# EAGLE design RF Glow Stick (EAGLE 6.5.0)
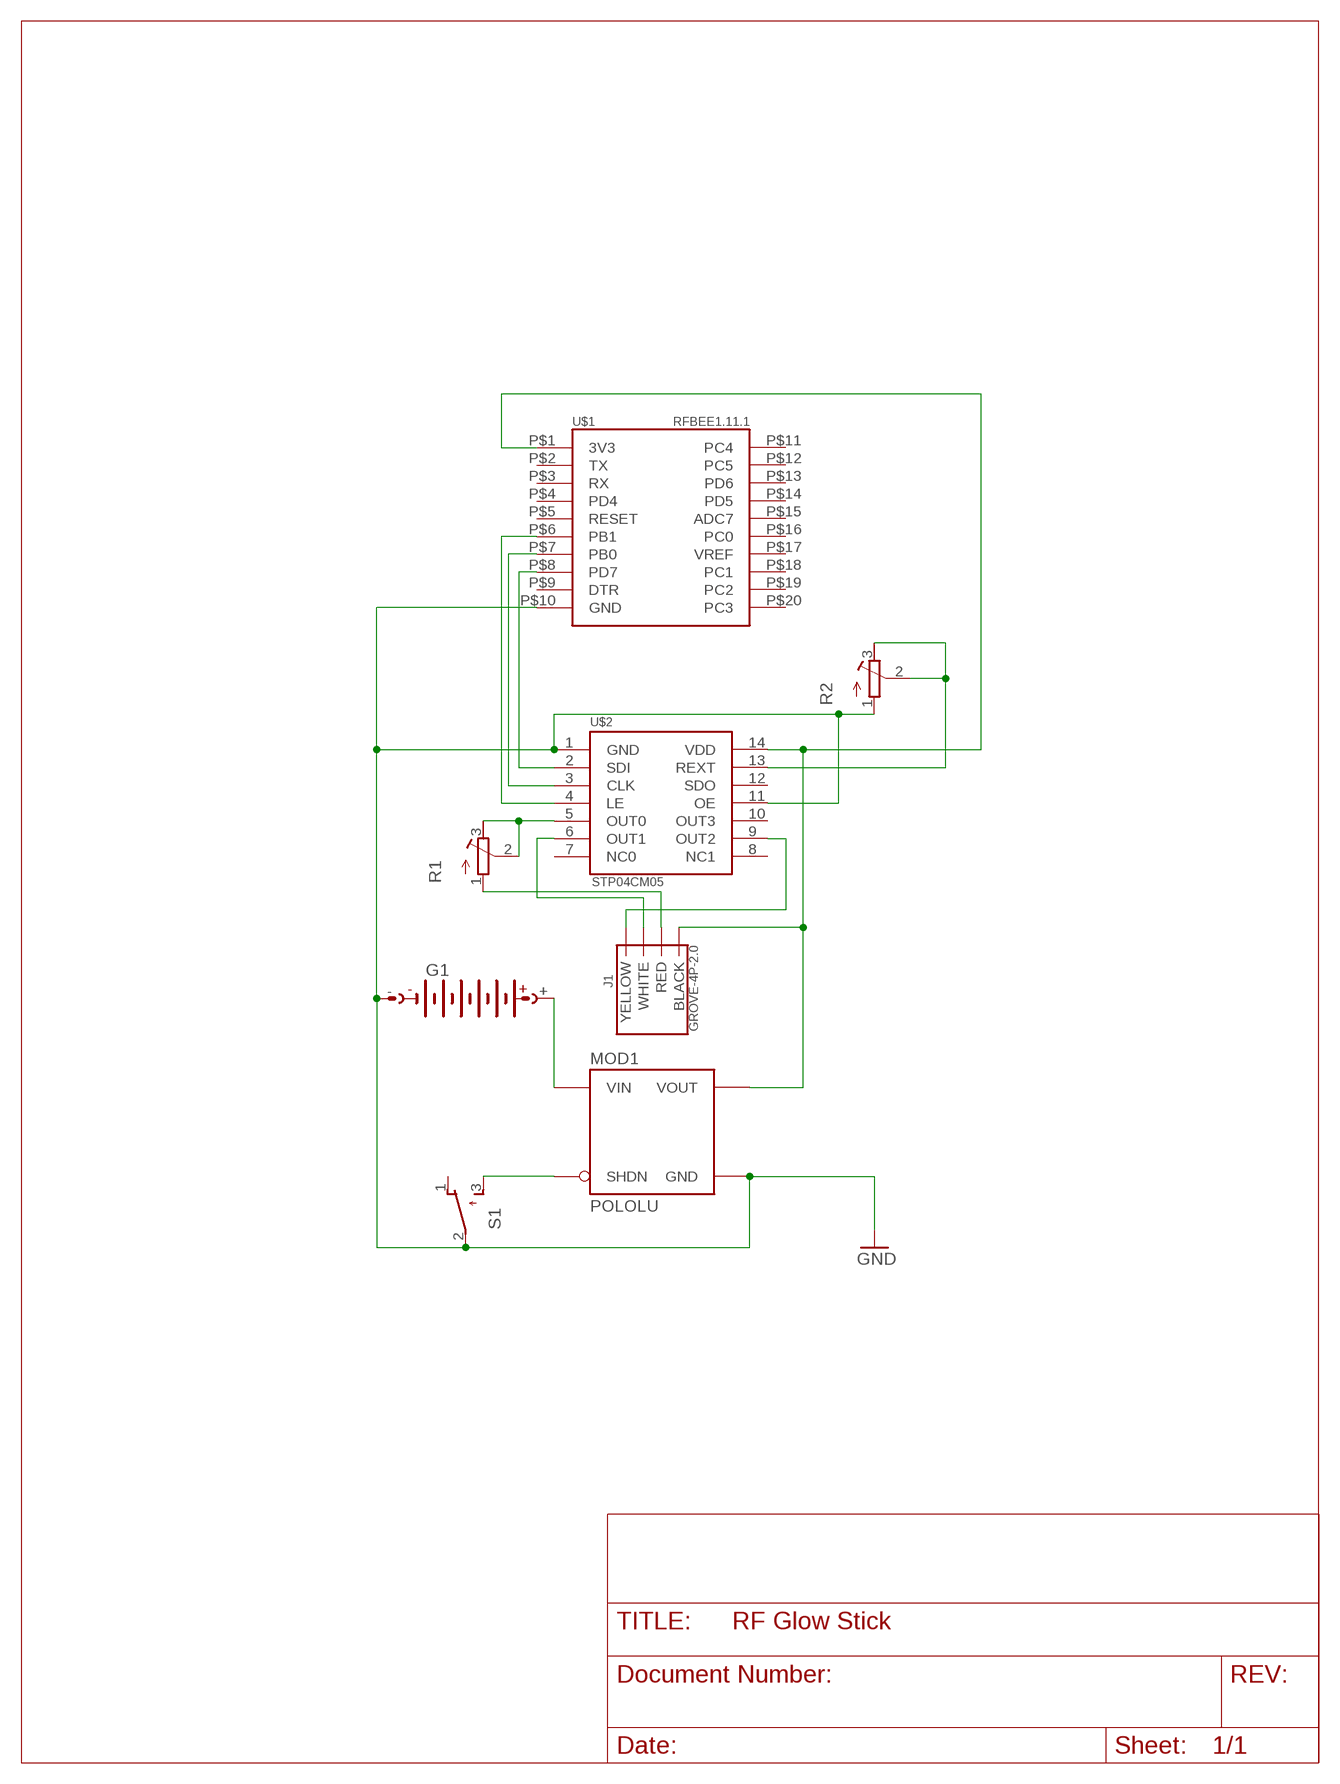
[diagram p0: schematic, sheet 1]

## Parts
G1  AB9V  [AB9V]
J1  GROVE-4P-2.0  [4P-2.0-90D]
MOD1  POLOLU  POLOLU_REG09BV  [POLOLU_REG09B]
R1  R-TRIMM3299W  [RTRIM3299W]
R2  R-TRIMM3299W  [RTRIM3299W]
S1  TL32PO  [TL3XPO]
U$1  RFBEE1.11.1  [RFBEE]
U$2  STP04CM05  STP04CM05STP04CM05  [DIL14]

## Nets
BATT: G1.+ MOD1.I(VIN)
GND: G1.- MOD1.G(GND) R2.1(A) S1.2(P) U$1.P$10(GND) U$2.1(GND) U$2.11(OE)
N$1: R1.2(S) R1.3(E) U$2.5(OUT0)
N$2: MOD1.S(SHDN) S1.3(S)
N$5: U$1.P$6(PB1) U$2.4(LE)
N$6: U$1.P$7(PB0) U$2.3(CLK)
N$7: U$1.P$8(PD7) U$2.2(SDI)
N$8: J1.RED R1.1(A)
N$9: J1.WHITE U$2.6(OUT1)
N$10: J1.YELLOW U$2.9(OUT2)
N$11: R2.2(S) R2.3(E) U$2.13(REXT)
VOUT: J1.BLACK MOD1.O(VOUT) U$1.P$1(3V3) U$2.14(VDD)
Unconnected: S1.1(O) U$1.P$2(TX) U$1.P$3(RX) U$1.P$4(PD4) U$1.P$5(RESET) U$1.P$9(DTR) U$1.P$11(PC4) U$1.P$12(PC5) U$1.P$13(PD6) U$1.P$14(PD5) U$1.P$15(ADC7) U$1.P$16(PC0) U$1.P$17(VREF) U$1.P$18(PC1) U$1.P$19(PC2) U$1.P$20(PC3) U$2.7(NC0) U$2.8(NC1) U$2.10(OUT3) U$2.12(SDO)

## Library data of the parts
G1 = battery:AB9V: 9-V BATTERY CLIP
J1 = My Library:GROVE-4P-2.0
MOD1 = My Library:POLOLU_REG09B*V: Pololu Adjustable Step Up/Down Voltage Regulators REG09B 0.4"x0.6" SOURCE www.pololu.com/ PACKAGE THT; 4-pin (0.1"); 0.4"x0.6"
R1 R2 = rcl:R-TRIMM: Trimm resistor
S1 = switch:TL32PO: TINY SWITCH ON - MOM Source: http://www2.produktinfo.conrad.com/datenblaetter/700000-724999/705152-da-01-de-Subminiaturschalter_TL_36YO.pdf
U$1 = My Library:RFBEE1.1: RFBee 1.1 from Seedstudio in XBEE form factor
U$2 = My Library:STP04CM05: STP04CM04 - LED Sink Driver 4-bit shift register LED sink driver

## Board
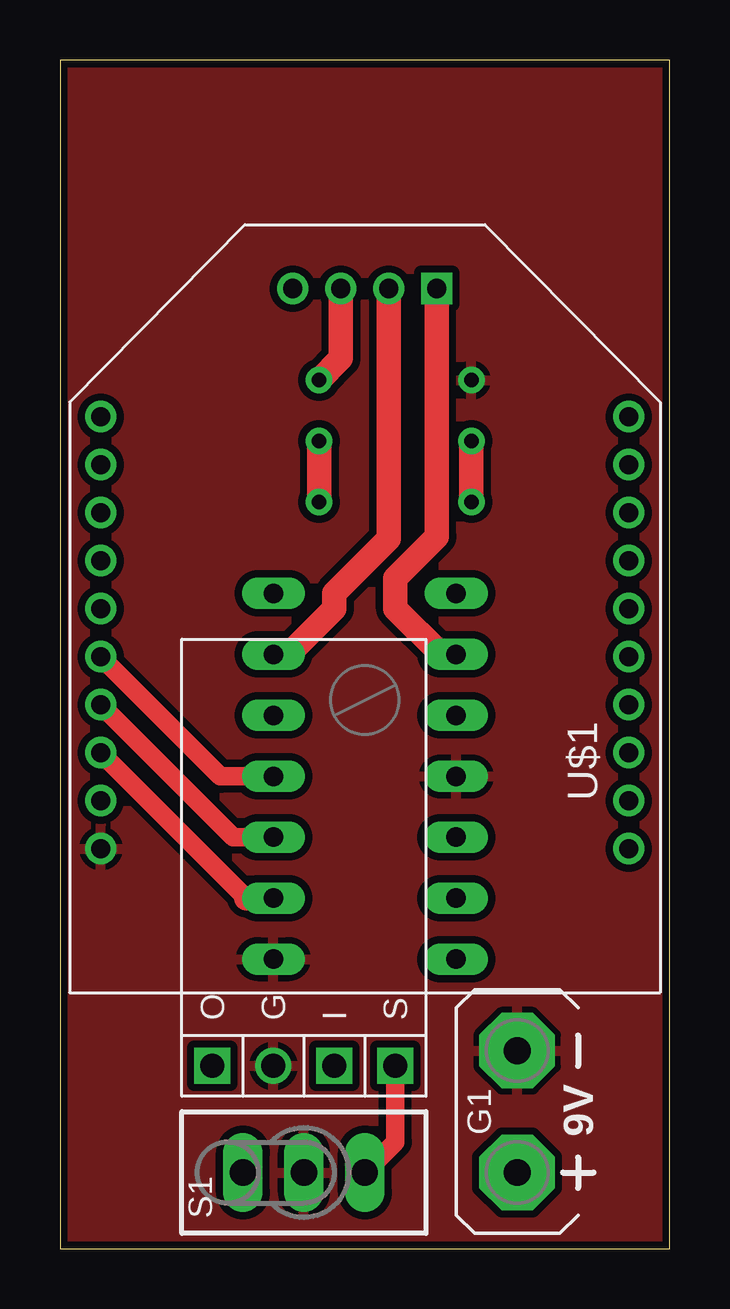
[diagram p1: board, top side]
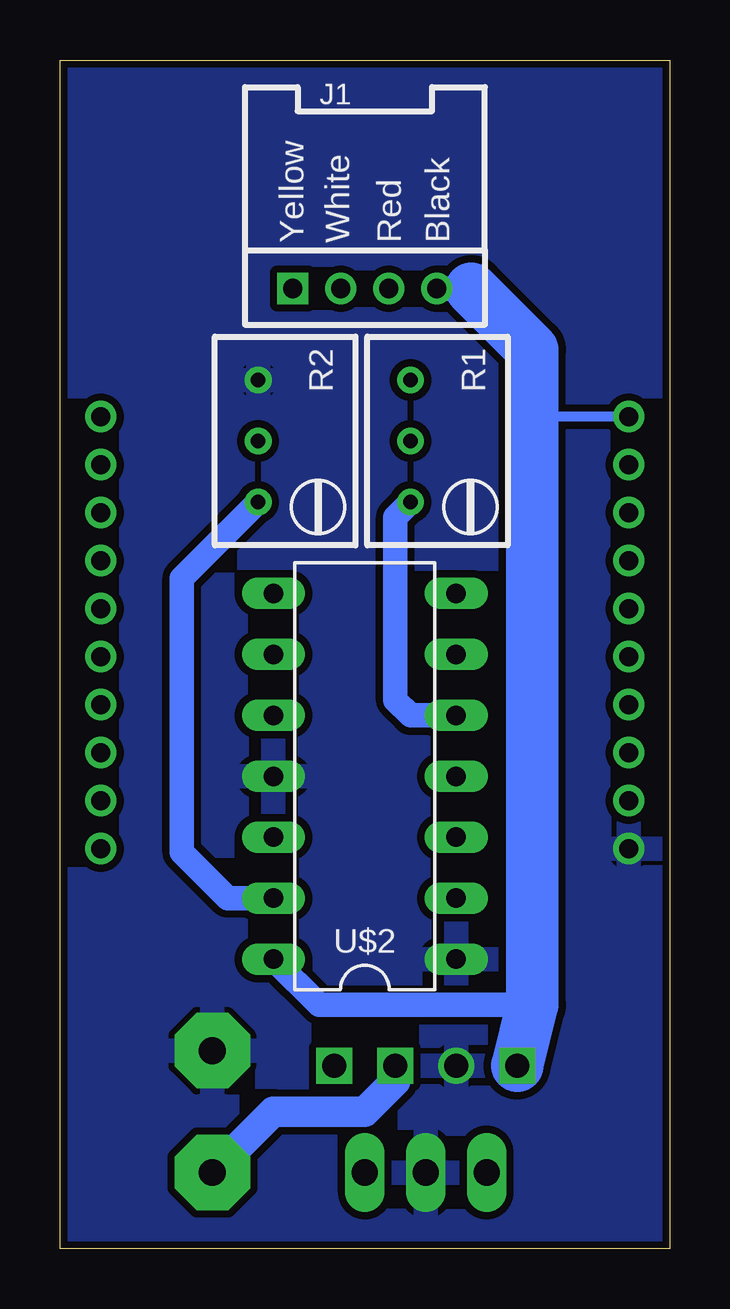
[diagram p2: board, bottom side, seen from below]

Size 25.4 x 49.53 mm. Coordinates in mm from the lower left corner, seen from the top.
Outline: 0,0 25.4,0 25.4,49.53 0,49.53 0,0
Copper layers (1*16): Top 0.035mm / dielectric 1.5mm / Bottom 0.035mm
Design rules "SeeedStudio_DRU_no_angle_2layer": minimum track width 6mil, minimum drill 12mil, track to track 6mil, track to pad 6mil, pad to pad 6mil, via to via 6mil, smd to smd 0mil, copper to edge 10mil, drill to drill 10mil, minimum pad ring 10mil, minimum via ring 6mil, stop-mask expansion 2mil, vias tented up to drill 25mil, thermal gap 10mil

### Footprints (pad centres in the part's own frame; a part is rotated, then mirrored left to right if it is on the bottom)
AB9V = drill 1.118 pad 3.15 octagon: + 0,2.54; - 0,-2.54
4P-2.0-90D = drill 0.8 pad 1.27: BLACK 3,0; RED 1,0; WHITE -1,0 | drill 0.8 pad 1.27 square: YELLOW -3,0
POLOLU_REG09B = drill 1: G -1.27,-8.89 | drill 1 square: I 1.27,-8.89; O -3.81,-8.89; S 3.81,-8.89
RTRIM3299W = drill 0.61: 1 1.27,-2.54; 2 1.27,0; 3 1.27,2.54
TL3XPO = drill 1.1 pad 1.422 long: 1 -2.54,0; 2 0,0; 3 2.54,0
RFBEE = drill 0.8: P$1 -11,8; P$2 -11,6; P$3 -11,4; P$4 -11,2; P$5 -11,0; P$6 -11,-2; P$7 -11,-4; P$8 -11,-6; P$9 -11,-8; P$10 -11,-10; P$11 11,8; P$12 11,6; P$13 11,4; P$14 11,2; P$15 11,0; P$16 11,-2; P$17 11,-4; P$18 11,-6; P$19 11,-8; P$20 11,-10
DIL14 = drill 0.813 long: 1 -7.62,-3.81; 2 -5.08,-3.81; 3 -2.54,-3.81; 4 0,-3.81; 5 2.54,-3.81; 6 5.08,-3.81; 7 7.62,-3.81; 8 7.62,3.81; 9 5.08,3.81; 10 2.54,3.81; 11 0,3.81; 12 -2.54,3.81; 13 -5.08,3.81; 14 -7.62,3.81

### Placement (x,y rotation side)
G1  19.05,5.71 180 top
J1  12.7,40.01 0 bottom
MOD1  10.16,16.51 0 top
R1  9.53,33.66 180 bottom
R2  15.88,33.66 180 bottom
S1  10.16,3.17 0 top
U$1  12.7,26.67 0 top
U$2  12.7,19.68 90 bottom

### Tracks (layer width: path | path; a pad name or v marks a point on that pad's centre or on a via)
BATT
  Bottom 1.016: 11.43,6.99 MOD1.I
  Bottom 1.27: G1.+ 16.51,5.71 12.7,5.71 11.43,6.99
GND
  Top 0.406: 17.14,19.68 U$2.11
  pour Top (isolate 0.305): -1.27,50.8 26.67,50.8 26.67,-1.27 -1.27,-1.27
  pour Bottom (isolate 0.305): -0.64,50.16 26.04,50.16 26.04,-0.64 -0.64,-0.64
N$1
  Top 1.016: R1.2 R1.3
  Bottom 1.016: R1.3 11.43,30.48 11.43,22.86 10.79,22.23 U$2.5
N$2
  Top 0.762: S1.3 13.97,4.45 MOD1.S
N$5
  Top 0.762: U$2.4 6.68,19.68 U$1.P$6
N$6
  Top 0.762: U$2.3 7.22,17.14 U$1.P$7
N$7
  Top 0.762: U$1.P$8 7.76,14.61
  Top 1.016: 7.76,14.61 U$2.2
N$8
  Top 1.016: J1.RED 11.7,37.1 R1.1
N$9
  Top 1.016: J1.WHITE 13.7,29.57 11.43,27.3 11.43,26.67 9.53,24.77 U$2.6
N$10
  Top 1.016: U$2.9 15.88,24.77 13.97,26.67 13.97,27.94 15.7,29.67 J1.YELLOW
N$11
  Top 1.016: R2.2 R2.3
  Bottom 1.016: R2.3 20.32,27.94 20.32,16.51 18.41,14.61 U$2.13
VOUT
  Bottom 0.406: 6.35,34.67 5.71,34.29 5.71,34.67 U$1.P$1
  Bottom 1.016: U$2.14 14.61,10.16 5.71,10.16 | J1.BLACK 8.26,40.01
  Bottom 2.184: MOD1.O 5.71,10.16 5.71,34.29 5.71,37.47 8.26,40.01